# EAGLE schematic RoomIndicator.Inside (EAGLE 6.4)
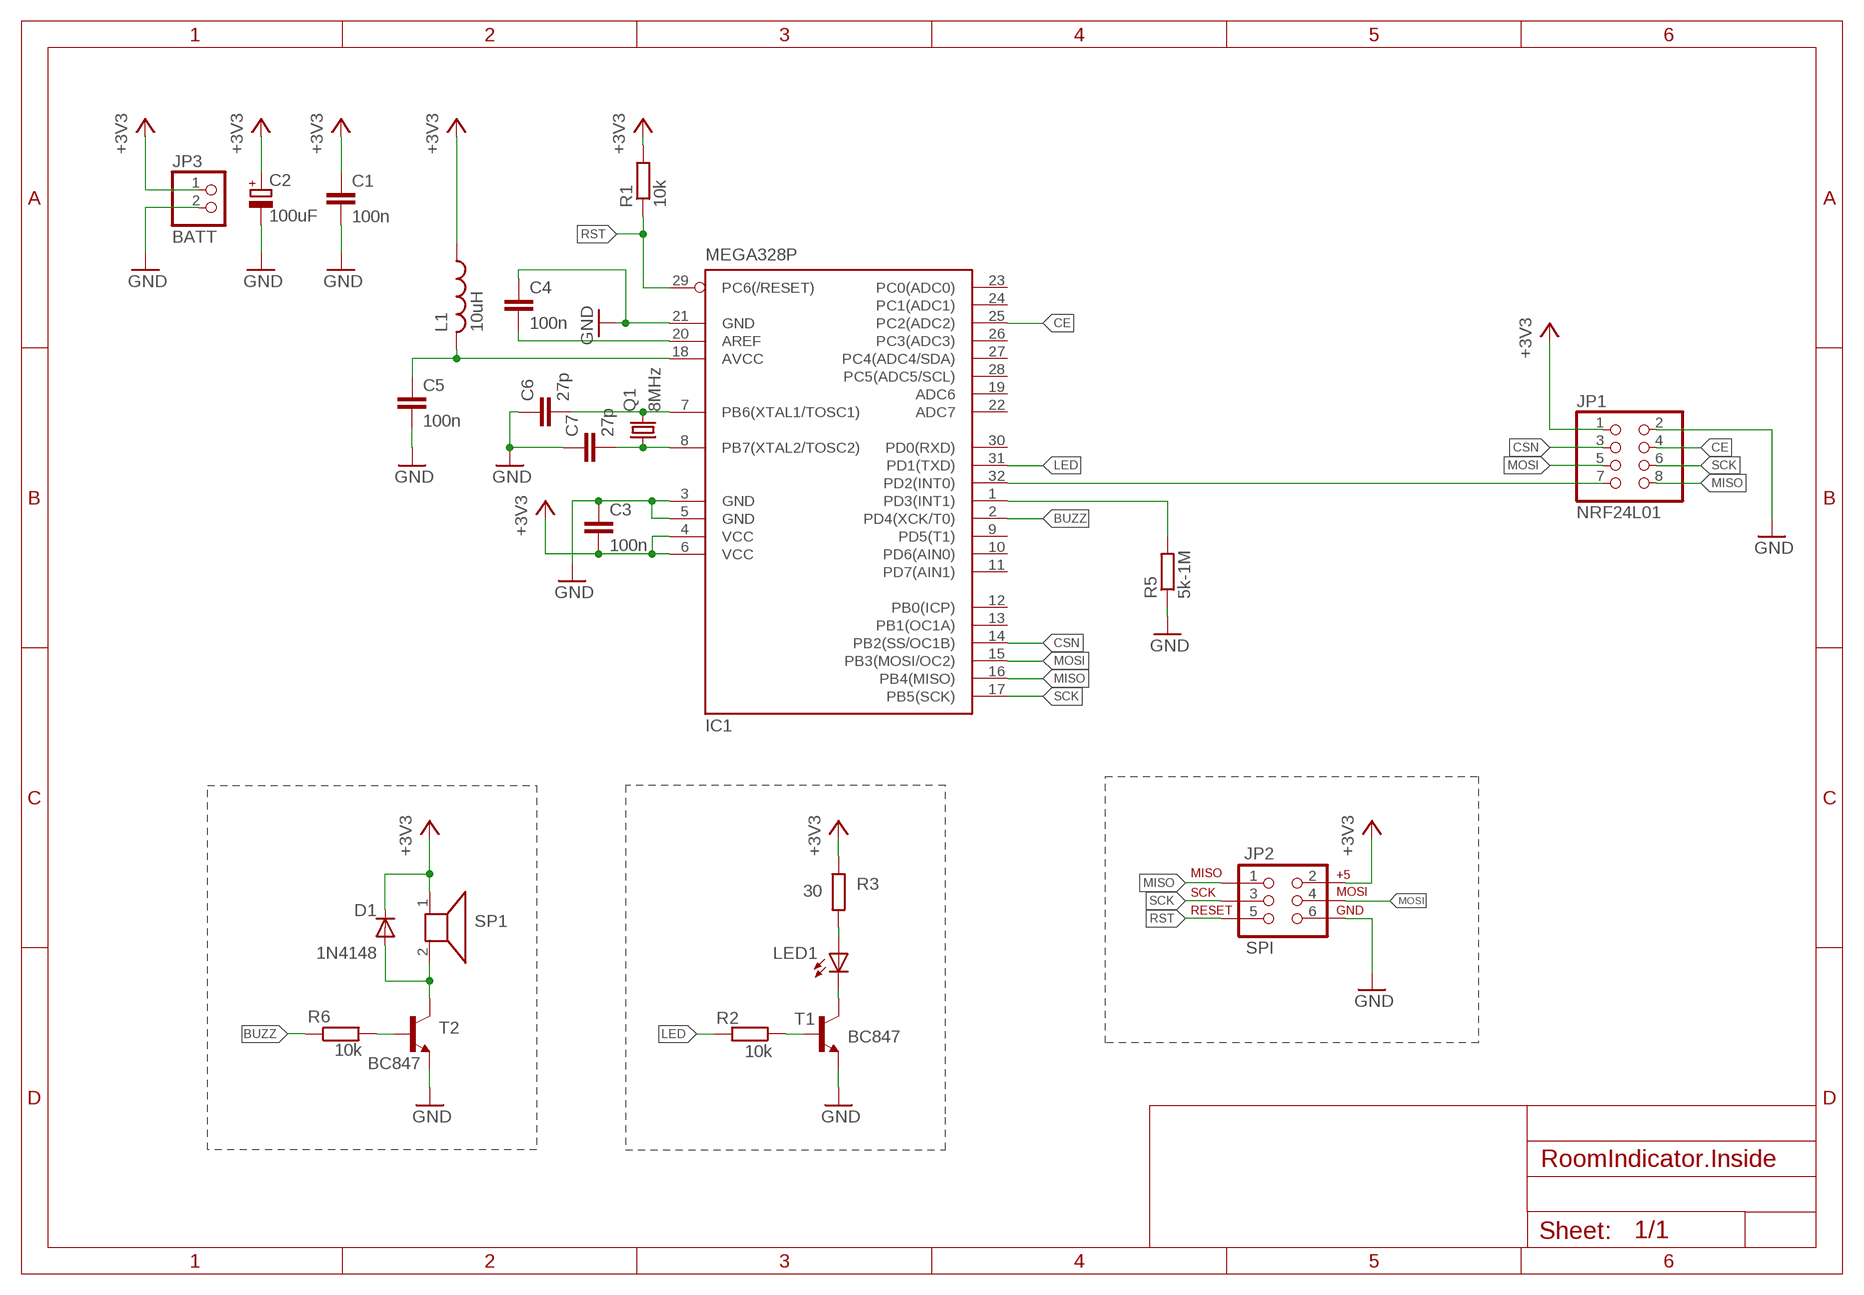
[diagram p0: schematic, sheet 1]

## Parts
C1  100n  C-EU025-025X050  [C025-025X050]
C2  100uF  CPOL-EUE2.5-5  [E2,5-5]
C3  100n  C-EUC0805K  [C0805K]
C4  100n  C-EUC0805K  [C0805K]
C5  100n  C-EUC0805K  [C0805K]
C6  27p  C-EUC0805K  [C0805K]
C7  27p  C-EUC0805K  [C0805K]
D1  1N4148  1N4148DO35-7  [DO35-7]
IC1  MEGA328P  MEGA8-AI  [TQFP32-08]
JP1  NRF24L01  PINHD-2X4  [2X04]
JP2  SPI  AVR_SPI_PRG_6PTH  [2X3]
JP3  BATT  PINHD-1X2  [1X02]
L1  10uH  L-US0204/7  [0204/7]
LED1  GREEN  LED5MM  [LED5MM]
Q1  8MHz  CRYSTALHC49S  [HC49/S]
R1  10k  R-EU_R0805  [R0805]
R2  10k  R-EU_R0805  [R0805]
R3  30  R-EU_0204/5  [0204/5]
R5  5k-1M  R-EU_0204/5  [0204/5]
R6  10k  R-EU_R0805  [R0805]
SP1  AL60P  [AL60P]
T1  BC847  [SOT23]
T2  BC847  [SOT23]

## Nets
+3V3: C1.1 C2.+ C3.2 D1.C IC1.4(VCC) IC1.6(VCC) JP1.1 JP2.2 JP3.1 L1.1 R1.2 R3.1 SP1.1
AVCC: C5.1 IC1.18(AVCC) L1.2
BUZZ: IC1.2(PD4(XCK/T0)) R6.1
CE: IC1.25(PC2(ADC2)) JP1.4
CSN: IC1.14(PB2(SS/OC1B)) JP1.3
GND: C1.2 C2.- C3.1 C4.1 C5.2 C6.1 C7.1 IC1.3(GND) IC1.5(GND) IC1.21(GND) JP1.2 JP2.6 JP3.2 R5.1 T1.2(E) T2.2(E)
INT0: IC1.32(PD2(INT0)) JP1.7
INT1: IC1.1(PD3(INT1)) R5.2
LED: IC1.31(PD1(TXD)) R2.2
MISO: IC1.16(PB4(MISO)) JP1.8 JP2.1
MOSI: IC1.15(PB3(MOSI/OC2)) JP1.5 JP2.4
N$4: C4.2 IC1.20(AREF)
N$5: R6.2 T2.1(B)
N$6: LED1.A R3.2
N$10: R2.1 T1.1(B)
N$11: LED1.K(C) T1.3(C)
N$16: D1.A SP1.2 T2.3(C)
RST: IC1.29(PC6(/RESET)) JP2.5 R1.1
SCK: IC1.17(PB5(SCK)) JP1.6 JP2.3
TOSC1: C6.2 IC1.7(PB6(XTAL1/TOSC1)) Q1.2
TOSC2: C7.2 IC1.8(PB7(XTAL2/TOSC2)) Q1.1
Unconnected: IC1.9(PD5(T1)) IC1.10(PD6(AIN0)) IC1.11(PD7(AIN1)) IC1.12(PB0(ICP)) IC1.13(PB1(OC1A)) IC1.19(ADC6) IC1.22(ADC7) IC1.23(PC0(ADC0)) IC1.24(PC1(ADC1)) IC1.26(PC3(ADC3)) IC1.27(PC4(ADC4/SDA)) IC1.28(PC5(ADC5/SCL)) IC1.30(PD0(RXD))

## Library data of the parts
C1 C3-C7 = rcl:C-EU: CAPACITOR, European symbol
C2 = rcl:CPOL-EU: POLARIZED CAPACITOR, European symbol
D1 = diode:1N4148: DIODE high speed (Philips)
IC1 = atmel:MEGA8: MICROCONTROLLER 8 Kbytes FLASH, 1 kbytes SRAM, 512 bytes EEPROM, USART, 6-channel 10 bit ADC, 2-channel 8 bit ADC Pin compatible with Atmega48, ATMega88, ATMega168 Source: avr.lbr; MPN: ATMEGA8-16AU; OC_FARNELL: 9171371; OC_NEWARK: 73M8863
JP1 = pinhead:PINHD-2X4: PIN HEADER
JP2 = SparkFun-Connectors:AVR_SPI_PRG_6: AVR ISP 6 Pin This is the reduced ISP connector for AVR programming. Common on Arduino. This footprint will take up less PCB space and can be used with a 10-pin to 6-pin adapter such as SKU: BOB-08508 **Special note about "TEST_POINT" package. The stop mask is on the top side, so if you want your programming test points to be on the bottom of your board, make sure to place this package on the bottom side of the board. This also ensure that the orientation to program from the bottom side will be correct.
JP3 = pinhead:PINHD-1X2: PIN HEADER
L1 = rcl:L-US: INDUCTOR, American symbol
LED1 = led:LED: LED OSRAM: - CHIPLED LG R971, LG N971, LY N971, LG Q971, LY Q971, LO R971, LY R971 LH N974, LH R974 LS Q976, LO Q976, LY Q976 LO Q996 - Hyper CHIPLED LW Q18S LB Q993, LB Q99A, LB R99A - SideLED LS A670, LO A670, LY A670, LG A670, LP A670 LB A673, LV A673, LT A673, LW A673 LH A674 LY A675 LS A676, LA A676, LO A676, LY A676, LW A676 LS A679, LY A679, LG A679 - Hyper Micro SIDELED® LS Y876, LA Y876, LO Y876, LY Y876 LT Y87S - SmartLED LW L88C, LW L88S LB L89C, LB L89S, LG L890 LS L89K, LO L89K, LY L89K LS L896, LA L896, LO L896, LY L896 - TOPLED LS T670, LO T670, LY T670, LG T670, LP T670 LSG T670, LSP T670, LSY T670, LOP T670, LYG T670 LG T671, LOG T671, LSG T671 LB T673, LV T673, LT T673, LW T673 LH T674 LS T676, LA T676, LO T676, LY T676, LB T676, LH T676, LSB T676, LW T676 LB T67C, LV T67C, LT T67C, LS T67K, LO T67K, LY T67K, LW E67C LS E67B, LA E67B, LO E67B, LY E67B, LB E67C, LV E67C, LT E67C LW T67C LS T679, LY T679, LG T679 LS T770, LO T770, LY T770, LG T770, LP T770 LB T773, LV T773, LT T773, LW T773 LH T774 LS E675, LA E675, LY E675, LS T675 LS T776, LA T776, LO T776, LY T776, LB T776 LHGB T686 LT T68C, LB T68C - Hyper Mini TOPLED® LB M676 - Mini TOPLED Santana® LG M470 LS M47K, LO M47K, LY M47K Source: http://www.osram.convergy.de LUXEON: - LUMILED® LXK2-PW12-R00, LXK2-PW12-S00, LXK2-PW14-U00, LXK2-PW14-V00 LXK2-PM12-R00, LXK2-PM12-S00, LXK2-PM14-U00 LXK2-PE12-Q00, LXK2-PE12-R00, LXK2-PE12-S00, LXK2-PE14-T00, LXK2-PE14-U00 LXK2-PB12-K00, LXK2-PB12-L00, LXK2-PB12-M00, LXK2-PB14-N00, LXK2-PB14-P00, LXK2-PB14-Q00 LXK2-PR12-L00, LXK2-PR12-M00, LXK2-PR14-Q00, LXK2-PR14-R00 LXK2-PD12-Q00, LXK2-PD12-R00, LXK2-PD12-S00 LXK2-PH12-R00, LXK2-PH12-S00 LXK2-PL12-P00, LXK2-PL12-Q00, LXK2-PL12-R00 Source: www.luxeon.com KINGBRIGHT: KA-3528ASYC Source: www.kingbright.com
Q1 = crystal:CRYSTAL: CRYSTAL; OC_FARNELL: 1667008; OC_NEWARK: unknown
R1-R3 R5 R6 = rcl:R-EU_: RESISTOR, European symbol
SP1 = buzzer:AL60P: SPEAKER Source: Buerklin; OC_FARNELL: unknown; OC_NEWARK: unknown
T1 T2 = transistor:BC847: NPN TRANSISTOR